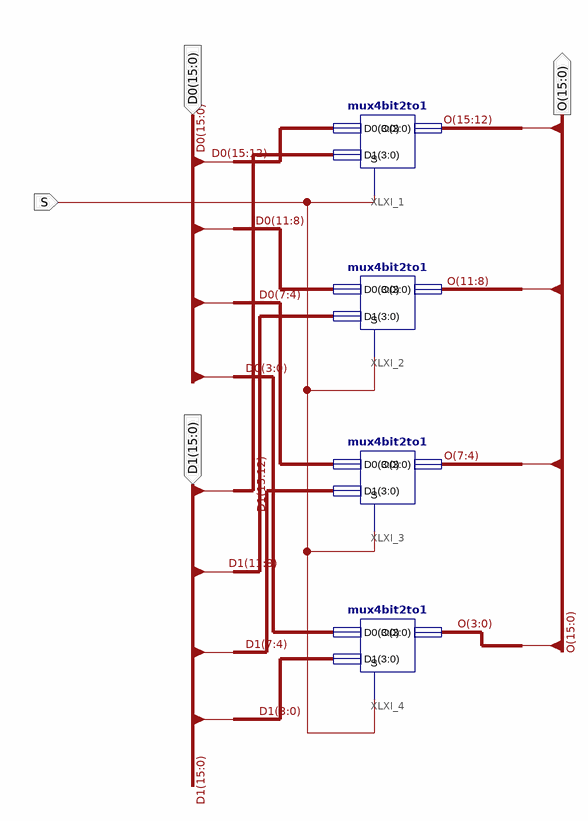
[diagram p0: schematic sheet 1]
// Xilinx ISE schematic mux16bit2to1.sch (spartan3e) as structural Verilog: 4 symbols, 4 ports
module mux16bit2to1 (
  input  [15:0] D0,
  input  [15:0] D1,
  input  S,
  output [15:0] O
);

  mux4bit2to1 XLXI_1 (.D0(D0[15:12]), .D1(D1[15:12]), .O(O[15:12]), .S(S));
  mux4bit2to1 XLXI_2 (.D0(D0[11:8]), .D1(D1[11:8]), .O(O[11:8]), .S(S));
  mux4bit2to1 XLXI_3 (.D0(D0[7:4]), .D1(D1[7:4]), .O(O[7:4]), .S(S));
  mux4bit2to1 XLXI_4 (.D0(D0[3:0]), .D1(D1[3:0]), .O(O[3:0]), .S(S));
endmodule
